# EAGLE design 6x5keyboard (EAGLE 6.4)
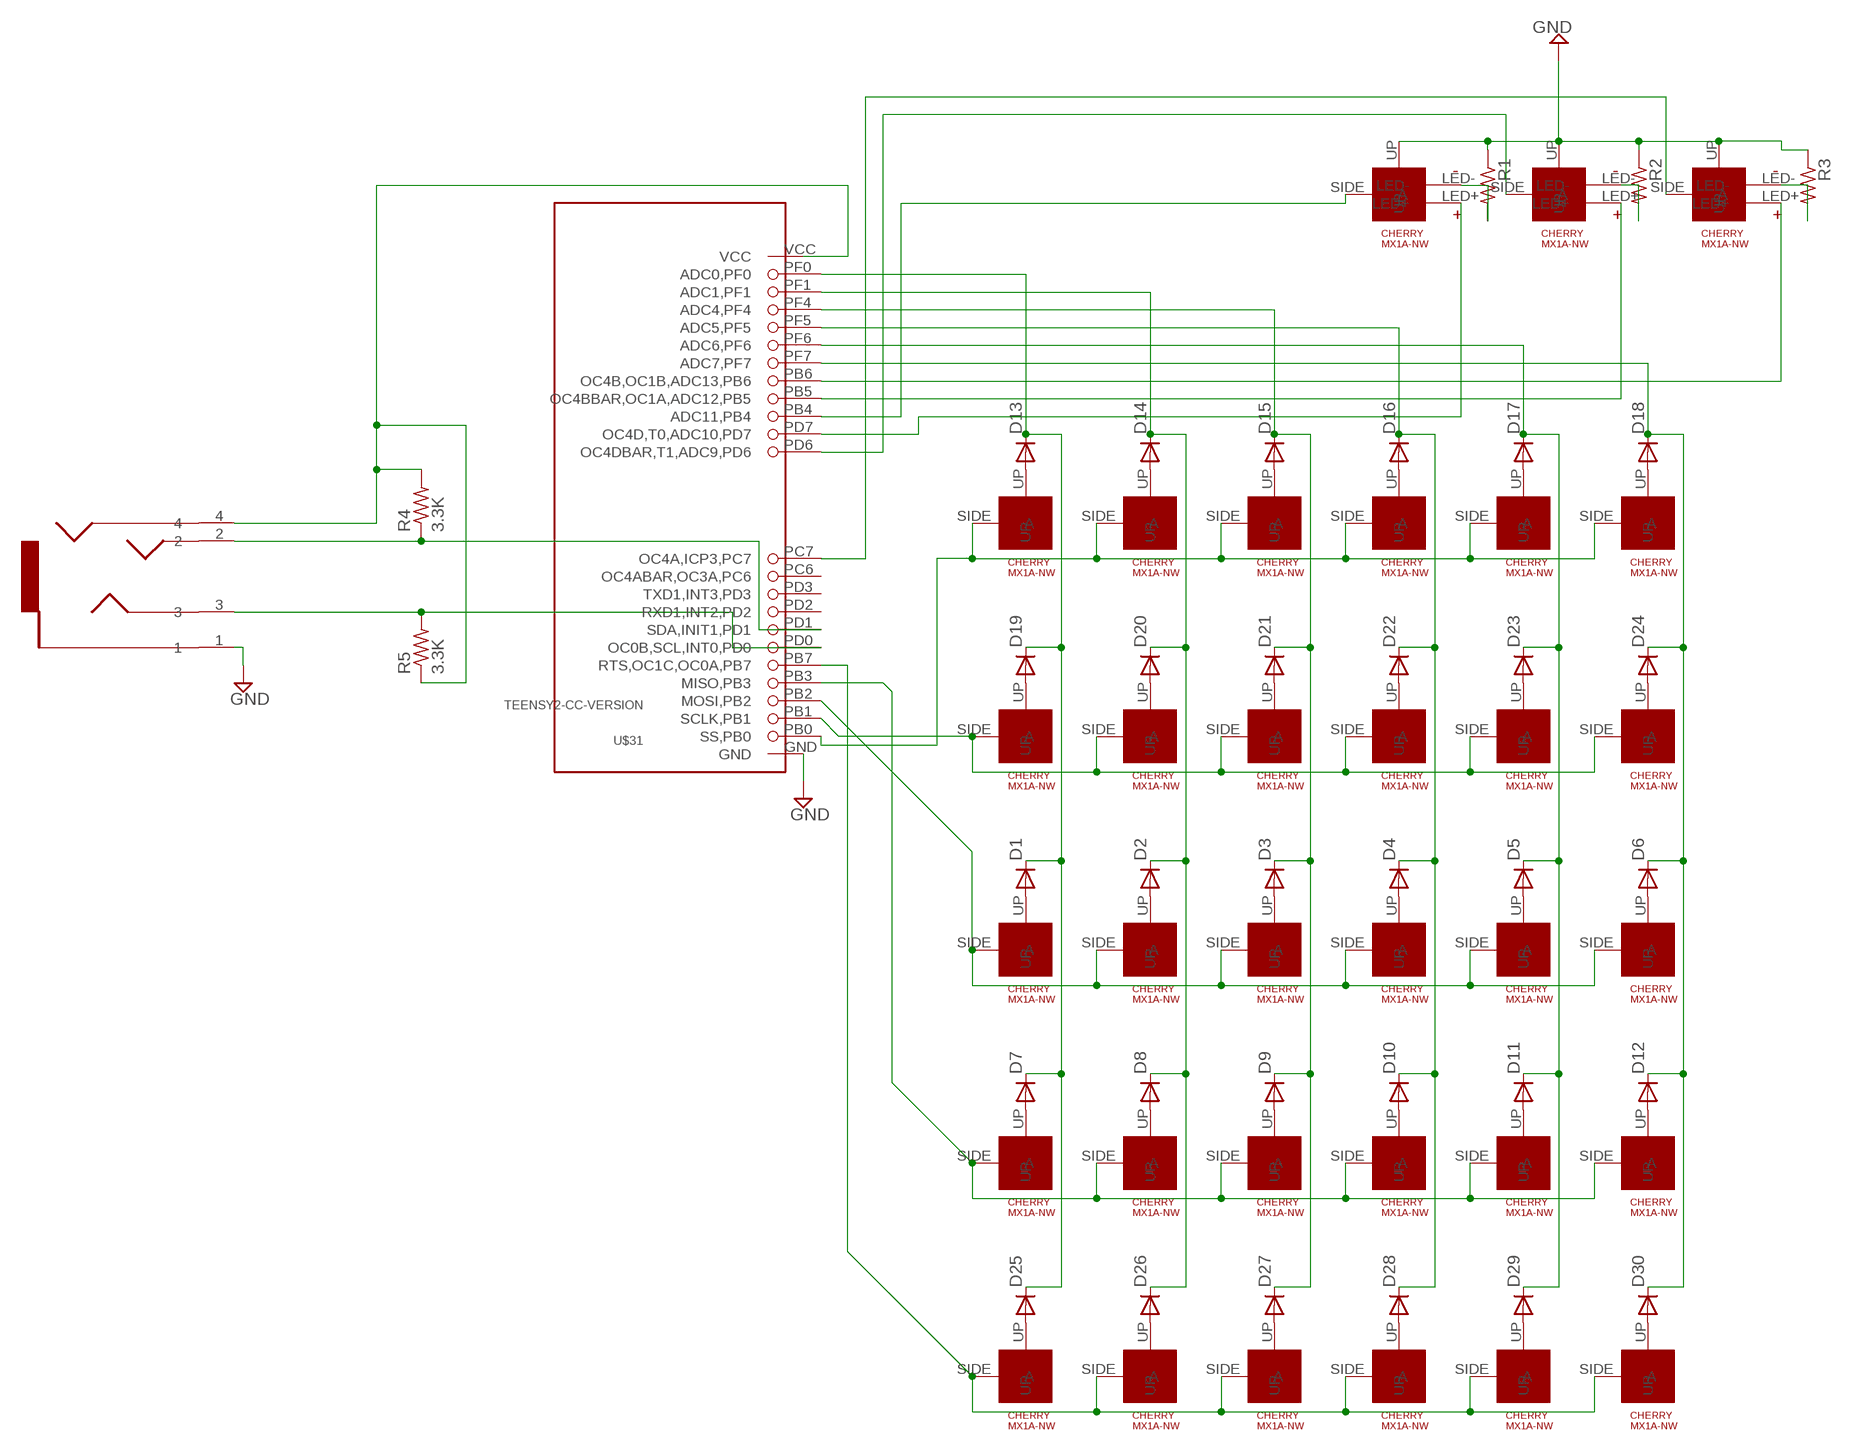
[diagram p0: schematic, sheet 1]

## Parts
COMM  SJ-43514_HEADPHONES_3.5MM_X4  [SJ-43514_HEADPHONES-3.5MM_X4]
D1  1N4148DO35-7  [DO35-7]
D2  1N4148DO35-7  [DO35-7]
D3  1N4148DO35-7  [DO35-7]
D4  1N4148DO35-7  [DO35-7]
D5  1N4148DO35-7  [DO35-7]
D6  1N4148DO35-7  [DO35-7]
D7  1N4148DO35-7  [DO35-7]
D8  1N4148DO35-7  [DO35-7]
D9  1N4148DO35-7  [DO35-7]
D10  1N4148DO35-7  [DO35-7]
D11  1N4148DO35-7  [DO35-7]
D12  1N4148DO35-7  [DO35-7]
D13  1N4148DO35-7  [DO35-7]
D14  1N4148DO35-7  [DO35-7]
D15  1N4148DO35-7  [DO35-7]
D16  1N4148DO35-7  [DO35-7]
D17  1N4148DO35-7  [DO35-7]
D18  1N4148DO35-7  [DO35-7]
D19  1N4148DO35-7  [DO35-7]
D20  1N4148DO35-7  [DO35-7]
D21  1N4148DO35-7  [DO35-7]
D22  1N4148DO35-7  [DO35-7]
D23  1N4148DO35-7  [DO35-7]
D24  1N4148DO35-7  [DO35-7]
D25  1N4148DO35-7  [DO35-7]
D26  1N4148DO35-7  [DO35-7]
D27  1N4148DO35-7  [DO35-7]
D28  1N4148DO35-7  [DO35-7]
D29  1N4148DO35-7  [DO35-7]
D30  1N4148DO35-7  [DO35-7]
R1  R-US_0207/10  [0207/10]
R2  R-US_0207/10  [0207/10]
R3  R-US_0207/10  [0207/10]
R4  3.3K  R-US_0207/10  [0207/10]
R5  3.3K  R-US_0207/10  [0207/10]
U$1  CHERRY-MX1A-E1NW  [CHERRYMX-NN]
U$2  CHERRY-MX1A-E1NW  [CHERRYMX-NN]
U$3  CHERRY-MX1A-E1NW  [CHERRYMX-NN]
U$4  CHERRY-MX1A-E1NW  [CHERRYMX-NN]
U$5  CHERRY-MX1A-E1NW  [CHERRYMX-NN]
U$6  CHERRY-MX1A-E1NW  [CHERRYMX-NN]
U$7  CHERRY-MX1A-E1NW  [CHERRYMX-NN]
U$8  CHERRY-MX1A-E1NW  [CHERRYMX-NN]
U$9  CHERRY-MX1A-E1NW  [CHERRYMX-NN]
U$10  CHERRY-MX1A-E1NW  [CHERRYMX-NN]
U$11  CHERRY-MX1A-E1NW  [CHERRYMX-NN]
U$12  CHERRY-MX1A-E1NW  [CHERRYMX-NN]
U$13  CHERRY-MX1A-E1NW  [CHERRYMX-NN]
U$14  CHERRY-MX1A-E1NW  [CHERRYMX-NN]
U$15  CHERRY-MX1A-E1NW  [CHERRYMX-NN]
U$16  CHERRY-MX1A-E1NW  [CHERRYMX-NN]
U$17  CHERRY-MX1A-E1NW  [CHERRYMX-NN]
U$18  CHERRY-MX1A-E1NW  [CHERRYMX-NN]
U$19  CHERRY-MX1A-E1NW  [CHERRYMX-NN]
U$20  CHERRY-MX1A-E1NW  [CHERRYMX-NN]
U$21  CHERRY-MX1A-E1NW  [CHERRYMX-NN]
U$22  CHERRY-MX1A-E1NW  [CHERRYMX-NN]
U$23  CHERRY-MX1A-E1NW  [CHERRYMX-NN]
U$24  CHERRY-MX1A-E1NW  [CHERRYMX-NN]
U$25  CHERRY-MX1A-E1NW  [CHERRYMX-NN]
U$26  CHERRY-MX1A-E1NW  [CHERRYMX-NN]
U$27  CHERRY-MX1A-E1NW  [CHERRYMX-NN]
U$28  CHERRY-MX1A-E1NW  [CHERRYMX-NN]
U$29  CHERRY-MX1A-E1NW  [CHERRYMX-NN]
U$30  CHERRY-MX1A-E1NW  [CHERRYMX-NN]
U$31  TEENSY2-CC-VERSION  [TEENSY2]
U$32  CHERRY-MX1A-E1NW-LED  [CHERRYMX-NN-LED]
U$33  CHERRY-MX1A-E1NW-LED  [CHERRYMX-NN-LED]
U$34  CHERRY-MX1A-E1NW-LED  [CHERRYMX-NN-LED]

## Nets
GND: COMM.1 R1.1 R2.1 R3.1 U$31.GND U$32.UP U$33.UP U$34.UP
N$1: D1.A U$2.UP
N$2: D2.A U$1.UP
N$3: D3.A U$3.UP
N$4: D4.A U$4.UP
N$5: D5.A U$5.UP
N$6: D6.A U$6.UP
N$7: D7.A U$7.UP
N$8: D8.A U$8.UP
N$9: D9.A U$9.UP
N$10: D10.A U$10.UP
N$11: D11.A U$11.UP
N$12: D12.A U$12.UP
N$13: D13.A U$13.UP
N$14: D14.A U$14.UP
N$15: D15.A U$15.UP
N$16: D16.A U$16.UP
N$17: D17.A U$17.UP
N$18: D18.A U$18.UP
N$19: D19.A U$19.UP
N$20: D20.A U$20.UP
N$21: D21.A U$21.UP
N$22: D22.A U$22.UP
N$23: D23.A U$23.UP
N$24: D24.A U$24.UP
N$25: D25.A U$25.UP
N$26: D26.A U$26.UP
N$27: D27.A U$27.UP
N$28: D28.A U$28.UP
N$29: D29.A U$29.UP
N$30: D30.A U$30.UP
N$31: D1.C D7.C D13.C D19.C D25.C U$31.PF0(ADC0,PF0)
N$32: D2.C D8.C D14.C D20.C D26.C U$31.PF1(ADC1,PF1)
N$33: D3.C D9.C D15.C D21.C D27.C U$31.PF4(ADC4,PF4)
N$34: D4.C D10.C D16.C D22.C D28.C U$31.PF5(ADC5,PF5)
N$35: D5.C D11.C D17.C D23.C D29.C U$31.PF6(ADC6,PF6)
N$36: D6.C D12.C D18.C D24.C D30.C U$31.PF7(ADC7,PF7)
N$37: U$19.SIDE(A) U$20.SIDE(A) U$21.SIDE(A) U$22.SIDE(A) U$23.SIDE(A) U$24.SIDE(A) U$31.PB1(SCLK,PB1)
N$38: U$1.SIDE(A) U$2.SIDE(A) U$3.SIDE(A) U$4.SIDE(A) U$5.SIDE(A) U$6.SIDE(A) U$31.PB2(MOSI,PB2)
N$39: U$7.SIDE(A) U$8.SIDE(A) U$9.SIDE(A) U$10.SIDE(A) U$11.SIDE(A) U$12.SIDE(A) U$31.PB3(MISO,PB3)
N$40: U$25.SIDE(A) U$26.SIDE(A) U$27.SIDE(A) U$28.SIDE(A) U$29.SIDE(A) U$30.SIDE(A) U$31.PB7(RTS,OC1C,OC0A,PB7)
N$41: U$13.SIDE(A) U$14.SIDE(A) U$15.SIDE(A) U$16.SIDE(A) U$17.SIDE(A) U$18.SIDE(A) U$31.PB0(SS,PB0)
N$42: R1.2 U$32.LED-
N$43: R2.2 U$33.LED-
N$44: R3.2 U$34.LED-
N$46: U$31.PB5(OC4BBAR,OC1A,ADC12,PB5) U$33.LED+
N$47: U$31.PB6(OC4B,OC1B,ADC13,PB6) U$34.LED+
N$48: U$31.PB4(ADC11,PB4) U$32.SIDE(A)
N$49: U$31.PD6(OC4DBAR,T1,ADC9,PD6) U$33.SIDE(A)
N$50: U$31.PC7(OC4A,ICP3,PC7) U$34.SIDE(A)
N$51: COMM.4 R4.2 R5.1 U$31.VCC
N$52: COMM.3 R5.2 U$31.PD0(OC0B,SCL,INT0,PD0)
N$53: COMM.2 R4.1 U$31.PD1(SDA,INIT1,PD1)
N$54: U$31.PD7(OC4D,T0,ADC10,PD7) U$32.LED+
Unconnected: U$31.PC6(OC4ABAR,OC3A,PC6) U$31.PD2(RXD1,INT2,PD2) U$31.PD3(TXD1,INT3,PD3)

## Library data of the parts
COMM = my_parts:SJ-43514_HEADPHONES_3.5MM_X4: This is for the SJ-43514 3.5mm 4-conductor headphone jack. Also works with SJ-4351X and SJ-43515TS
D1-D30 = diode:1N4148: DIODE high speed (Philips)
R1-R3 = rcl:R-US_: RESISTOR, American symbol
R4 R5 = resistor:R-US_: RESISTOR, American symbol
U$1-U$30 = my_parts:CHERRY-MX1A-E1NW: Cherry MX NW key
U$31 = teensy2:TEENSY2-C
U$32-U$34 = my_parts:CHERRY-MX1A-E1NW-LED: A cherry MX NW switch, but also with a place to put a LED

## Board
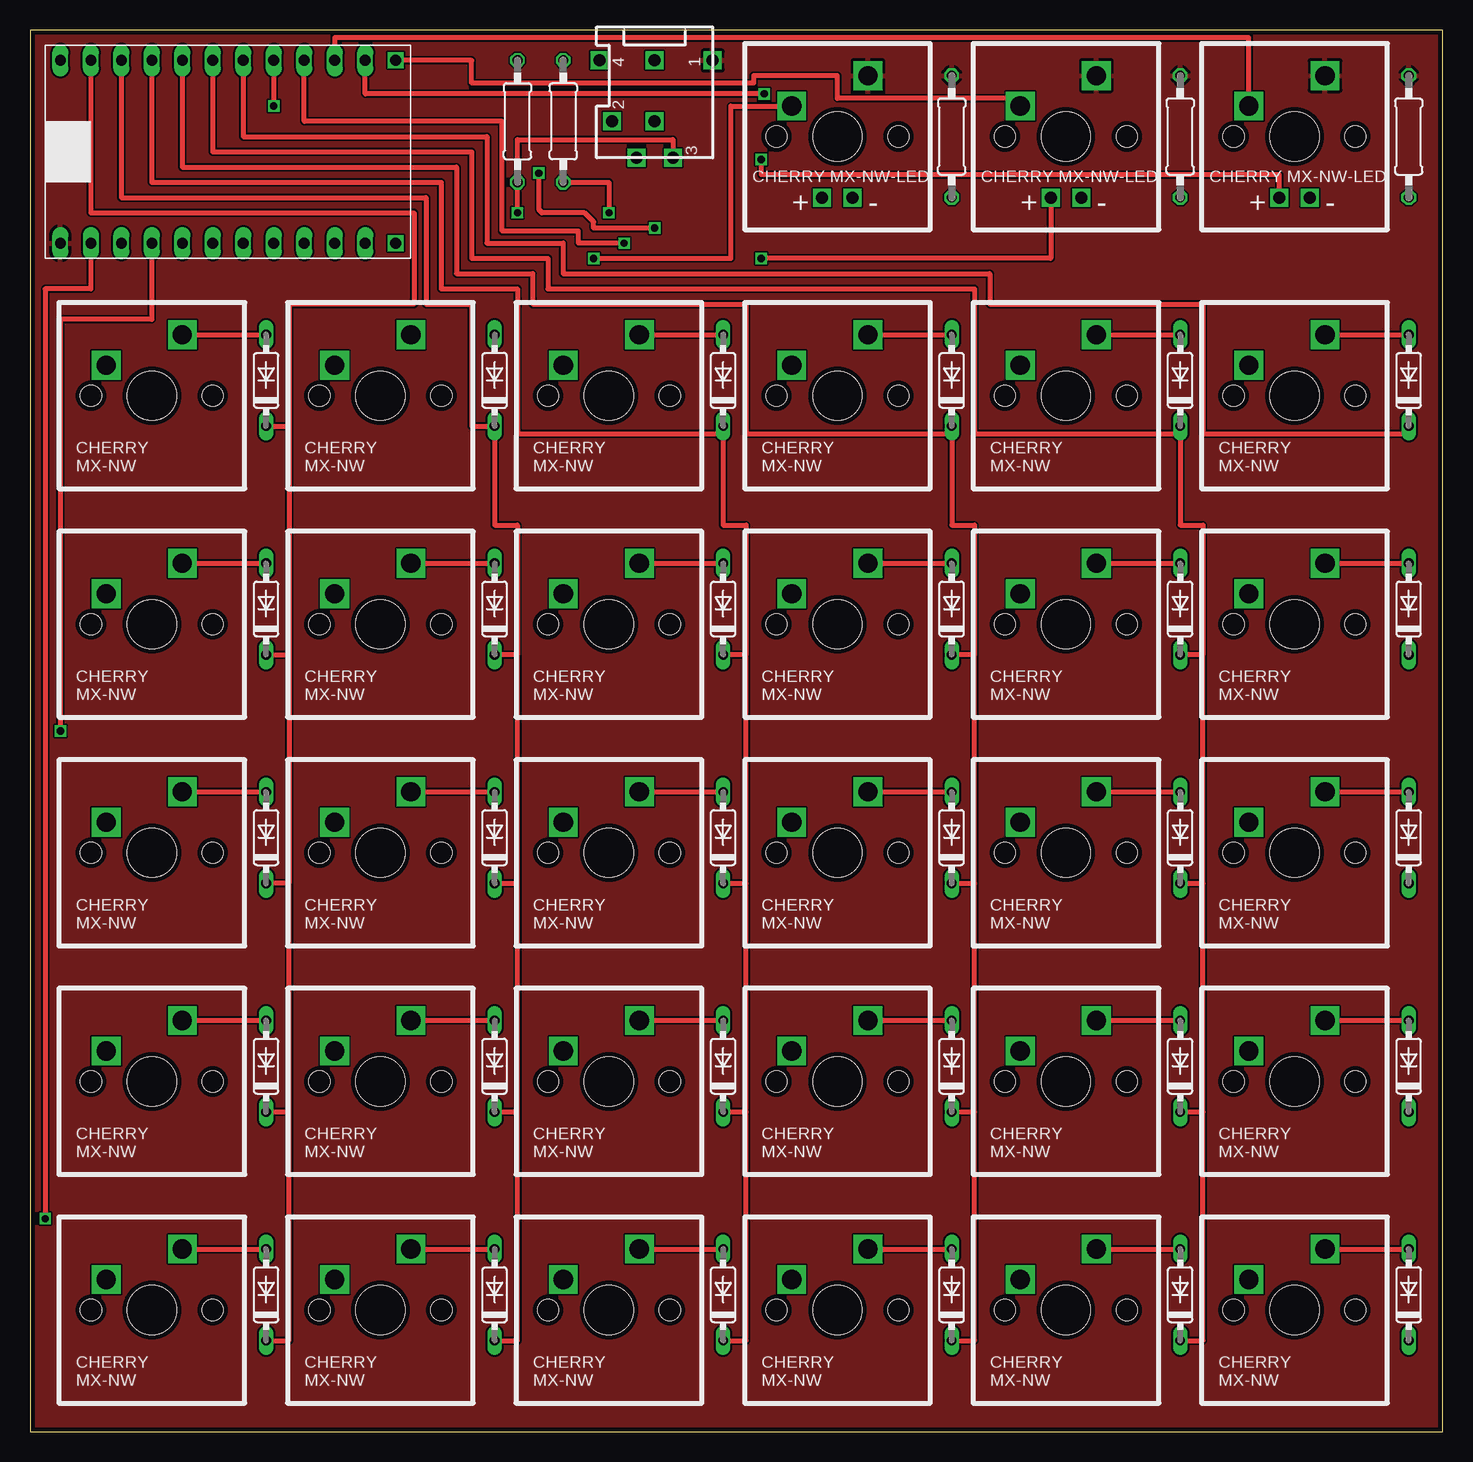
[diagram p1: board, top side]
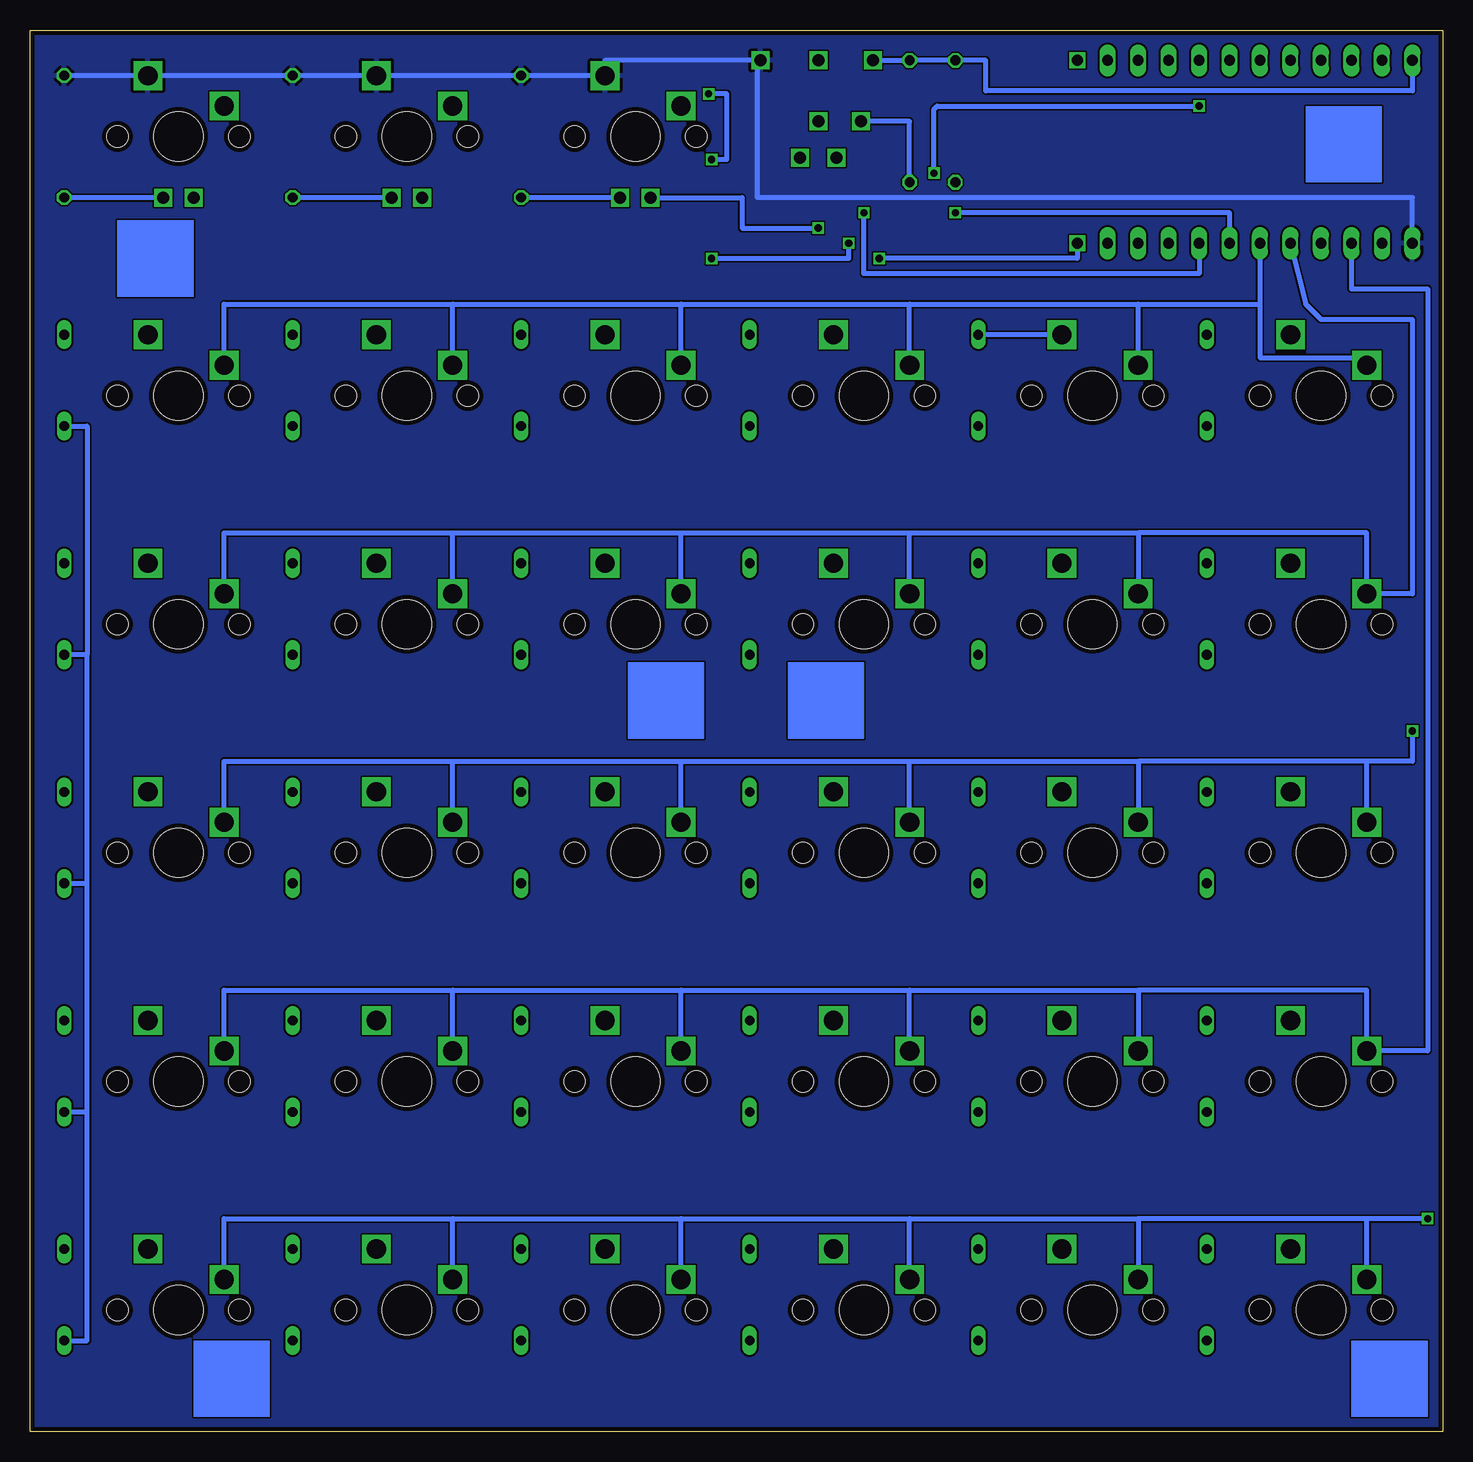
[diagram p2: board, bottom side, seen from below]

Size 117.78 x 116.83 mm. Coordinates in mm from the lower left corner, seen from the top.
Outline: 0,0 117.78,0 117.78,116.83 0,116.83 0,0
Copper layers (1*16): Top 0.0356mm / dielectric 1.5011mm / Bottom 0.0356mm
Design rules "LaenPCBOrder": minimum track width 6mil, minimum drill 13mil, track to track 6mil, track to pad 6mil, pad to pad 6mil, via to via 6mil, smd to smd 6mil, copper to edge 15mil, drill to drill 6mil, minimum pad ring 7mil, minimum via ring 7mil, stop-mask expansion 4mil, vias tented up to drill 0mil, thermal gap 10mil

### Footprints (pad centres in the part's own frame; a part is rotated, then mirrored left to right if it is on the bottom)
SJ-43514_HEADPHONES-3.5MM_X4 = drill 1 square: 1 0,4.826; 2 5.08,-3.556; 3 8.128,1.524; 4 0,-4.572; 5 8.128,-1.524; NC 0,0; NC2 5.08,0
DO35-7 = drill 0.813 long: A 3.81,0; C -3.81,0
0207/10 = drill 0.813 octagon: 1 -5.08,0; 2 5.08,0
CHERRYMX-NN = drill 1.6 square: SIDE -3.81,2.54; UP 2.54,5.08 | hole 1.753: -5.08,0; 5.08,0 | hole 4.089: 0,0
TEENSY2 = drill 0.9 long: GND -7.62,16.51; PB0 -7.62,13.97; PB1 -7.62,11.43; PB2 -7.62,8.89; PB3 -7.62,6.35; PB4 7.62,-6.35; PB5 7.62,-3.81; PB6 7.62,-1.27; PB7 -7.62,3.81; PC6 -7.62,-8.89; PD0 -7.62,1.27; PD1 -7.62,-1.27; PD2 -7.62,-3.81; PD3 -7.62,-6.35; PD7 7.62,-8.89; PF0 7.62,13.97; PF1 7.62,11.43; PF4 7.62,8.89; PF5 7.62,6.35; PF6 7.62,3.81; PF7 7.62,1.27; VCC 7.62,16.51 | drill 0.9 square: PC7 -7.62,-11.43; PD6 7.62,-11.43
CHERRYMX-NN-LED = drill 1 square: LED+ -1.27,-5.08; LED- 1.27,-5.08 | drill 1.6 square: SIDE -3.81,2.54; UP 2.54,5.08 | hole 1.753: -5.08,0; 5.08,0 | hole 4.089: 0,0

### Placement (x,y rotation side)
COMM  52.07,114.3 270 top
D1  19.68,49.53 90 top
D2  38.73,49.53 90 top
D3  57.78,49.53 90 top
D4  76.84,49.53 90 top
D5  95.89,49.53 90 top
D6  114.94,49.53 90 top
D7  19.68,68.58 90 top
D8  38.73,68.58 90 top
D9  57.78,68.58 90 top
D10  76.84,68.58 90 top
D11  95.89,68.58 90 top
D12  114.94,68.58 90 top
D13  19.68,11.43 90 top
D14  38.73,11.43 90 top
D15  57.78,11.43 90 top
D16  76.84,11.43 90 top
D17  95.89,11.43 90 top
D18  114.94,11.43 90 top
D19  19.68,30.48 90 top
D20  38.73,30.48 90 top
D21  57.78,30.48 90 top
D22  76.84,30.48 90 top
D23  95.89,30.48 90 top
D24  114.94,30.48 90 top
D25  19.68,87.63 90 top
D26  38.73,87.63 90 top
D27  57.78,87.63 90 top
D28  76.84,87.63 90 top
D29  95.89,87.63 90 top
D30  114.94,87.63 90 top
R1  114.94,107.95 270 top
R2  95.89,107.95 270 top
R3  76.84,107.95 270 top
R4  44.45,109.22 90 top
R5  40.64,109.22 270 top
U$1  29.21,48.26 0 top
U$2  10.16,48.26 0 top
U$3  48.26,48.26 0 top
U$4  67.31,48.26 0 top
U$5  86.36,48.26 0 top
U$6  105.41,48.26 0 top
U$7  10.16,67.31 0 top
U$8  29.21,67.31 0 top
U$9  48.26,67.31 0 top
U$10  67.31,67.31 0 top
U$11  86.36,67.31 0 top
U$12  105.41,67.31 0 top
U$13  10.16,10.16 0 top
U$14  29.21,10.16 0 top
U$15  48.26,10.16 0 top
U$16  67.31,10.16 0 top
U$17  86.36,10.16 0 top
U$18  105.41,10.16 0 top
U$19  10.16,29.21 0 top
U$20  29.21,29.21 0 top
U$21  48.26,29.21 0 top
U$22  67.31,29.21 0 top
U$23  86.36,29.21 0 top
U$24  105.41,29.21 0 top
U$25  10.16,86.36 0 top
U$26  29.21,86.36 0 top
U$27  48.26,86.36 0 top
U$28  67.31,86.36 0 top
U$29  86.36,86.36 0 top
U$30  105.41,86.36 0 top
U$31  19.05,106.68 90 top
U$32  105.41,107.95 0 top
U$33  86.36,107.95 0 top
U$34  67.31,107.95 0 top

### Tracks (layer width: path | path; a pad name or v marks a point on that pad's centre or on a via)
GND
  Bottom 0.406: U$31.GND 2.54,102.87 57.15,102.87 57.15,114.3 | 57.15,114.3 COMM.1 | R1.1 U$32.UP R2.1 U$33.UP R3.1 U$34.UP 69.85,114.3 57.15,114.3
  pour Bottom: 0,116.84 118.11,116.84 118.11,0 0,0
  pour Top: 0,116.84 118.11,116.84 118.11,0 0,0
N$1
  Top 0.406: U$2.UP D1.A
N$2
  Top 0.406: U$1.UP D2.A
N$3
  Top 0.406: U$3.UP D3.A
N$4
  Top 0.406: U$4.UP D4.A
N$5
  Top 0.406: U$5.UP D5.A
N$6
  Top 0.406: U$6.UP D6.A
N$7
  Top 0.406: U$7.UP D7.A
N$8
  Top 0.406: U$8.UP D8.A
N$9
  Top 0.406: U$9.UP D9.A
N$10
  Top 0.406: U$10.UP D10.A
N$11
  Top 0.406: U$11.UP D11.A
N$12
  Top 0.406: U$12.UP D12.A
N$13
  Top 0.406: U$13.UP D13.A
N$14
  Top 0.406: U$14.UP D14.A
N$15
  Top 0.406: U$15.UP D15.A
N$16
  Top 0.406: U$16.UP D16.A
N$17
  Top 0.406: U$17.UP D17.A
N$18
  Top 0.406: U$18.UP D18.A
N$19
  Top 0.406: U$19.UP D19.A
N$20
  Top 0.406: U$20.UP D20.A
N$21
  Top 0.406: U$21.UP D21.A
N$22
  Top 0.406: U$22.UP D22.A
N$23
  Top 0.406: U$23.UP D23.A
N$24
  Top 0.406: U$24.UP D24.A
N$25
  Top 0.406: U$25.UP D25.A
N$26
  Bottom 0.406: U$26.UP D26.A
N$27
  Top 0.406: U$27.UP D27.A
N$28
  Top 0.406: U$28.UP D28.A
N$29
  Top 0.406: U$29.UP D29.A
N$30
  Top 0.406: U$30.UP D30.A
N$31
  Top 0.406: U$31.PF0 5.08,101.6 32,101.6 32,93.98 21.59,93.98 21.59,83.82 | D25.C 21.59,83.82 | 21.59,83.82 21.59,64.77 | D7.C 21.59,64.77 | 21.59,64.77 21.59,45.72 | 21.59,45.72 D1.C | D19.C 21.59,26.67 | 21.59,26.67 21.59,45.72 | D13.C 21.59,7.62 21.59,26.67
N$32
  Top 0.406: U$31.PF1 7.62,102.87 33.02,102.87 33.02,93.98 36.83,93.98 36.83,83.82 D26.C 38.73,75.56 40.64,75.56 40.64,64.77 | 40.64,64.77 D8.C | D2.C 40.64,45.72 | 40.64,45.72 40.64,64.77 | D20.C 40.64,26.67 | 40.64,26.67 40.64,45.72 | D14.C 40.64,7.62 40.64,26.67
N$33
  Top 0.406: U$31.PF4 10.16,104.14 34.29,104.14 34.29,95.25 40.64,95.25 40.64,83.19 57.78,83.19 D27.C 57.78,75.56 59.69,75.56 59.69,64.77 | 59.69,64.77 D9.C | D3.C 59.69,45.72 | 59.69,45.72 59.69,64.77 | D21.C 59.69,26.67 | 59.69,26.67 59.69,45.72 | D15.C 59.69,7.62 59.69,26.67
N$34
  Top 0.406: U$31.PF5 12.7,105.41 35.56,105.41 35.56,96.52 41.91,96.52 41.91,93.98 59.69,93.98 59.69,83.19 76.84,83.19 D28.C 76.84,75.56 78.74,75.56 78.74,64.77 | 78.74,64.77 D10.C | D4.C 78.74,45.72 | 78.74,45.72 78.74,64.77 | D22.C 78.74,26.67 | 78.74,26.67 78.74,45.72 | D16.C 78.74,7.62 78.74,26.67
N$35
  Top 0.406: U$31.PF6 15.24,106.68 36.83,106.68 36.83,97.79 43.18,97.79 43.18,95.25 78.74,95.25 78.74,83.19 95.89,83.19 D29.C 95.89,75.56 97.79,75.56 97.79,64.77 | 97.79,64.77 D11.C | D5.C 97.79,45.72 | 97.79,45.72 97.79,64.77 | D23.C 97.79,26.67 | 97.79,26.67 97.79,45.72 | D17.C 97.79,7.62 97.79,26.67
N$36
  Top 0.406: U$31.PF7 17.78,107.95 38.1,107.95 38.1,99.06 44.45,99.06 44.45,96.52 80.01,96.52 80.01,93.98 97.79,93.98 97.79,83.19 114.94,83.19 D30.C
  Bottom 0.406: D30.C 113.03,83.82 113.03,64.77 | 113.03,64.77 D12.C | D6.C 113.03,45.72 | 113.03,45.72 113.03,64.77 | D24.C 113.03,26.67 | 113.03,26.67 113.03,45.72 | D18.C 113.03,7.62 113.03,26.67
N$37
  Bottom 0.406: U$31.PB1 7.62,95.25 1.27,95.25 1.27,31.75 U$19.SIDE 6.35,36.83 25.4,36.83 | 25.4,36.83 U$20.SIDE | U$21.SIDE 44.45,36.83 | 44.45,36.83 25.4,36.83 | U$22.SIDE 63.5,36.83 | 63.5,36.83 44.45,36.83 | U$23.SIDE 82.55,36.83 | 82.55,36.83 63.5,36.83 | U$24.SIDE 101.6,36.83 82.55,36.83
N$38  (via drill 0.6)
  Top 0.406: U$31.PB2 10.16,92.71 2.54,92.71 v2.54,58.42
  Bottom 0.406: U$2.SIDE 6.35,55.88 | 6.35,55.88 25.4,55.88 | 25.4,55.88 U$1.SIDE | U$3.SIDE 44.45,55.88 | 44.45,55.88 25.4,55.88 | U$4.SIDE 63.5,55.88 | 63.5,55.88 44.45,55.88 | U$5.SIDE 82.55,55.88 | 82.55,55.88 63.5,55.88 | U$6.SIDE 101.6,55.88 82.55,55.88 | v2.54,58.42 2.54,55.88 6.35,55.88
N$39
  Bottom 0.406: U$31.PB3 11.43,93.98 10.16,92.71 2.54,92.71 2.54,69.85 U$7.SIDE 6.35,74.93 25.4,74.93 | 25.4,74.93 U$8.SIDE | U$9.SIDE 44.45,74.93 | 44.45,74.93 25.4,74.93 | U$10.SIDE 63.5,74.93 | 63.5,74.93 44.45,74.93 | U$11.SIDE 82.55,74.93 | 82.55,74.93 63.5,74.93 | U$12.SIDE 101.6,74.93 82.55,74.93
N$40
  Bottom 0.406: U$31.PB7 15.24,93.98 | 15.24,93.98 15.24,89.53 6.35,89.53 U$25.SIDE | U$26.SIDE 25.4,93.98 | 25.4,93.98 15.24,93.98 | U$29.SIDE 82.55,93.98 | 82.55,93.98 63.5,93.98 | U$30.SIDE 101.6,93.98 82.55,93.98 | U$27.SIDE 44.45,93.98 | 44.45,93.98 25.4,93.98 | U$28.SIDE 63.5,93.98 | 63.5,93.98 44.45,93.98
N$41  (via drill 0.6)
  Top 0.406: U$31.PB0 5.08,95.25 1.27,95.25 v1.27,17.78
  Bottom 0.406: U$13.SIDE 6.35,17.78 | 6.35,17.78 25.4,17.78 | 25.4,17.78 U$14.SIDE | U$15.SIDE 44.45,17.78 | 44.45,17.78 25.4,17.78 | U$16.SIDE 63.5,17.78 | 63.5,17.78 44.45,17.78 | U$17.SIDE 82.55,17.78 | 82.55,17.78 63.5,17.78 | U$18.SIDE 101.6,17.78 82.55,17.78 | v1.27,17.78 6.35,17.78
N$42
  Bottom 0.406: U$32.LED- R1.2
N$43
  Bottom 0.406: U$33.LED- R2.2
N$44
  Bottom 0.406: U$34.LED- R3.2
N$46  (via drill 0.6)
  Top 0.406: U$33.LED+ 85.09,97.79 v60.96,97.79 | v49.53,99.06 45.72,99.06 45.72,100.08 39.37,100.08 39.37,109.22 22.86,109.22 U$31.PB5
  Bottom 0.406: v60.96,97.79 49.53,97.79 v49.53,99.06
N$47  (via drill 0.6)
  Top 0.406: v52.07,100.33 46.99,100.33 46.99,100.84 46.23,101.6 42.67,101.6 42.42,101.85 v42.42,104.9 | U$31.PB6 v20.32,110.49
  Bottom 0.406: U$34.LED+ 58.42,102.87 58.42,100.33 v52.07,100.33 | v42.42,104.9 42.42,110.24 42.16,110.49 v20.32,110.49
N$48
  Top 0.406: U$32.SIDE 101.6,116.21 25.4,116.21 U$31.PB4
N$49
  Top 0.406: U$33.SIDE 82.55,111.12 67.31,111.12 67.31,113.03 60.32,113.03 60.32,112.39 36.83,112.39 36.83,114.3 U$31.PD6
N$50  (via drill 0.6)
  Top 0.406: U$34.SIDE 58.42,110.49 58.42,97.79 v46.99,97.79
  Bottom 0.406: U$31.PC7 30.48,97.79 v46.99,97.79
N$51
  Bottom 0.406: U$31.VCC 2.54,111.76 38.1,111.76 38.1,114.3 R5.1 R4.2 COMM.4
N$52  (via drill 0.6)
  Top 0.406: COMM.3 53.59,107.7 40.64,107.7 R5.2 v40.64,101.6
  Bottom 0.406: U$31.PD0 17.78,101.6 v40.64,101.6
N$53  (via drill 0.6)
  Top 0.406: R4.1 48.26,104.14 v48.26,101.6
  Bottom 0.406: R4.1 44.45,109.22 COMM.2 | U$31.PD1 20.32,96.52 48.26,96.52 v48.26,101.6
N$54  (via drill 0.6)
  Top 0.406: U$32.LED+ 104.14,104.78 60.96,104.78 v60.96,106.05 | v61.21,111.51 27.94,111.51 U$31.PD7
  Bottom 0.406: v60.96,106.05 59.69,106.05 59.69,111.51 v61.21,111.51
(copper drawn outside any net)
  shapes: Bottom area x6